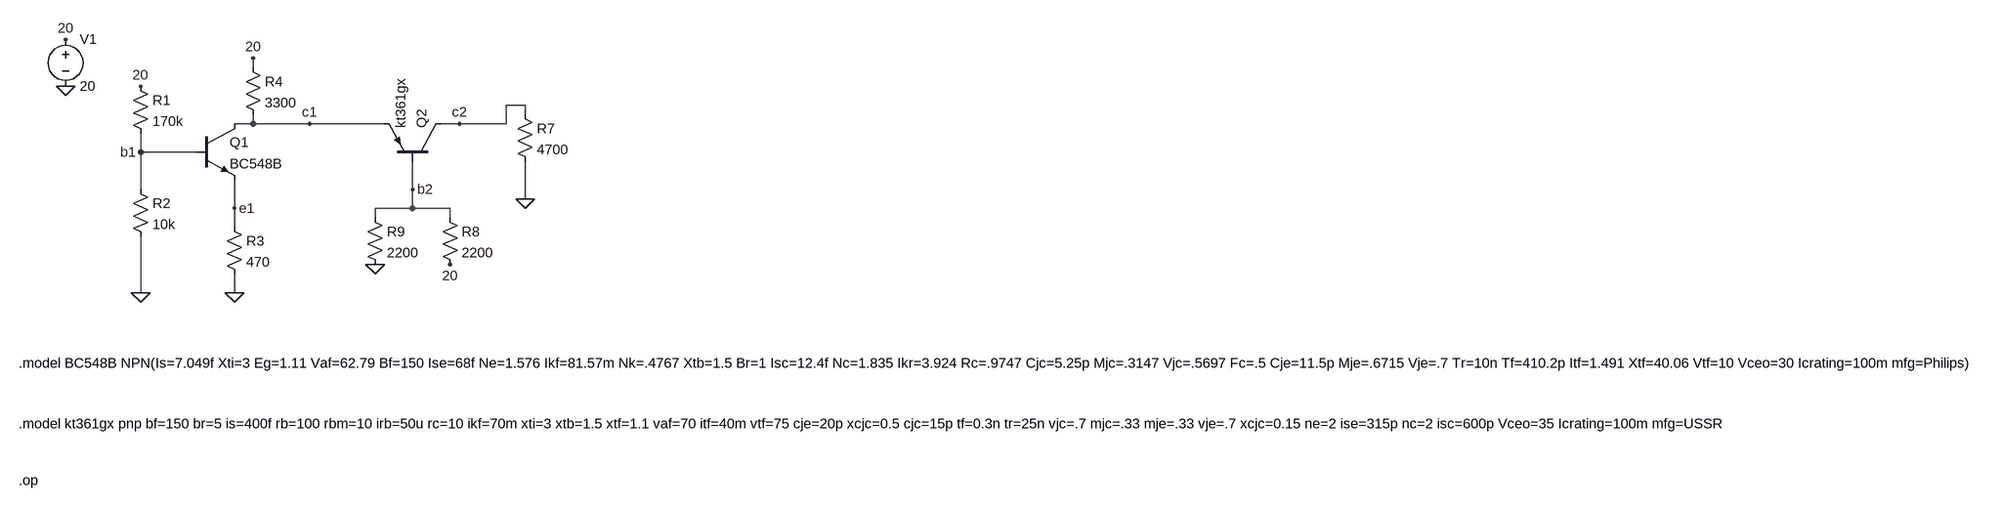
[diagram p0: schematic 181223polarizacion.asc]
181223polarizacion.asc, the LTspice schematic file:
Version 4
SHEET 1 3576 680
WIRE 256 -64 256 -80
WIRE 720 0 688 0
WIRE 720 16 720 0
WIRE 256 32 256 16
WIRE 256 32 224 32
WIRE 352 32 256 32
WIRE 480 32 352 32
WIRE 608 32 576 32
WIRE 688 32 688 0
WIRE 688 32 608 32
WIRE 64 80 64 48
WIRE 160 80 64 80
WIRE 64 144 64 80
WIRE 528 144 528 96
WIRE 720 160 720 96
WIRE 224 176 224 128
WIRE 528 176 528 144
WIRE 528 176 464 176
WIRE 592 176 528 176
WIRE 464 192 464 176
WIRE 592 192 592 176
WIRE 224 208 224 176
WIRE 64 320 64 224
WIRE 224 320 224 288
FLAG 720 160 0
FLAG 64 320 0
FLAG 608 32 c2
FLAG -64 -32 0
FLAG 464 272 0
FLAG -64 -112 20
FLAG 256 -80 20
FLAG 64 -32 20
FLAG 592 272 20
FLAG 224 320 0
FLAG 352 32 c1
FLAG 64 80 b1
FLAG 224 176 e1
FLAG 528 144 b2
SYMBOL res 48 -48 R0
SYMATTR InstName R1
SYMATTR Value 170k
SYMBOL res 48 128 R0
SYMATTR InstName R2
SYMATTR Value 10k
SYMBOL res 240 -80 R0
SYMATTR InstName R4
SYMATTR Value 3300
SYMBOL res 704 0 R0
SYMATTR InstName R7
SYMATTR Value 4700
SYMBOL pnp 576 96 M270
SYMATTR InstName Q2
SYMATTR Value kt361gx
SYMBOL voltage -64 -128 R0
SYMATTR InstName V1
SYMATTR Value 20
SYMBOL res 576 176 R0
SYMATTR InstName R8
SYMATTR Value 2200
SYMBOL res 448 176 R0
SYMATTR InstName R9
SYMATTR Value 2200
SYMBOL npn 160 32 R0
SYMATTR InstName Q1
SYMATTR Value BC548B
SYMBOL res 208 192 R0
SYMATTR InstName R3
SYMATTR Value 470
TEXT -144 440 Left 2 !.model BC548B NPN(Is=7.049f Xti=3 Eg=1.11 Vaf=62.79 Bf=150 Ise=68f Ne=1.576 Ikf=81.57m Nk=.4767 Xtb=1.5 Br=1 Isc=12.4f Nc=1.835 Ikr=3.924 Rc=.9747 Cjc=5.25p Mjc=.3147 Vjc=.5697 Fc=.5 Cje=11.5p Mje=.6715 Vje=.7 Tr=10n Tf=410.2p Itf=1.491 Xtf=40.06 Vtf=10 Vceo=30 Icrating=100m mfg=Philips)
TEXT -144 544 Left 2 !.model kt361gx pnp bf=150 br=5 is=400f rb=100 rbm=10 irb=50u rc=10 ikf=70m xti=3 xtb=1.5 xtf=1.1 vaf=70 itf=40m vtf=75 cje=20p xcjc=0.5 cjc=15p tf=0.3n tr=25n vjc=.7 mjc=.33 mje=.33 vje=.7 xcjc=0.15 ne=2 ise=315p nc=2 isc=600p Vceo=35 Icrating=100m mfg=USSR
TEXT -144 640 Left 2 !.op

The netlist it stands for:
* 181223polarizacion.asc
R1 20 b1 170k
R2 b1 0 10k
R4 20 c1 3300
R7 c2 0 4700
Q2 c2 b2 c1 0 kt361gx
V1 20 0 20
R8 b2 20 2200
R9 b2 0 2200
Q1 c1 b1 e1 0 BC548B
R3 e1 0 470
.model NPN NPN
.model PNP PNP
.lib standard.bjt
.model BC548B NPN(Is=7.049f Xti=3 Eg=1.11 Vaf=62.79 Bf=150 Ise=68f Ne=1.576 Ikf=81.57m Nk=.4767 Xtb=1.5 Br=1 Isc=12.4f Nc=1.835 Ikr=3.924 Rc=.9747 Cjc=5.25p Mjc=.3147 Vjc=.5697 Fc=.5 Cje=11.5p Mje=.6715 Vje=.7 Tr=10n Tf=410.2p Itf=1.491 Xtf=40.06 Vtf=10 Vceo=30 Icrating=100m mfg=Philips)
.model kt361gx pnp bf=150 br=5 is=400f rb=100 rbm=10 irb=50u rc=10 ikf=70m xti=3 xtb=1.5 xtf=1.1 vaf=70 itf=40m vtf=75 cje=20p xcjc=0.5 cjc=15p tf=0.3n tr=25n vjc=.7 mjc=.33 mje=.33 vje=.7 xcjc=0.15 ne=2 ise=315p nc=2 isc=600p Vceo=35 Icrating=100m mfg=USSR
.op
.backanno
.end

* Results of the author's LTspice run, read from the files saved beside the schematic
* Operating Point:
*   V(20) = 20 V
*   V(b1) = 1.058 V
*   V(c1) = 10.62 V
*   V(c2) = 9.206 V
*   V(b2) = 10.04 V
*   V(e1) = 401.5 mV
*   Ic(Q2) = -1.959 mA
*   Ib(Q2) = -35.48 µA
*   Ie(Q2) = 1.994 mA
*   Ic(Q1) = 848.7 µA
*   Ib(Q1) = 5.623 µA
*   Ie(Q1) = -854.3 µA
*   I(R1) = 111.4 µA
*   I(R2) = 105.8 µA
*   I(R4) = 2.843 mA
*   I(R7) = 1.959 mA
*   I(R8) = -4.528 mA
*   I(R9) = 4.563 mA
*   I(R3) = 854.3 µA
*   I(V1) = -7.482 mA
* From the log:
*   Semiconductor Device Operating Points:
*                           --- Bipolar Transistors ---
*   Name:       q2          q1
*   Model:    kt361gx     bc548b
*   Ib:      -3.55e-05    5.62e-06
*   Ic:      -1.96e-03    8.49e-04
*   Vbe:     -5.80e-01    6.56e-01
*   Vbc:      8.33e-01   -9.56e+00
*   Vce:     -1.41e+00    1.02e+01
*   BetaDC:   5.52e+01    1.51e+02
*   Gm:       7.37e-02    3.25e-02
*   Rpi:      1.06e+03    4.81e+03
*   Rx:       6.04e+01    0.00e+00
*   Ro:       3.62e+04    8.52e+04
*   Cbe:      5.28e-11    4.24e-11
*   Cbc:      1.74e-12    2.12e-12
*   Cjs:      0.00e+00    0.00e+00
*   BetaAC:   7.82e+01    1.56e+02
*   Cbx:      9.89e-12    0.00e+00
*   Ft:       1.82e+08    1.16e+08